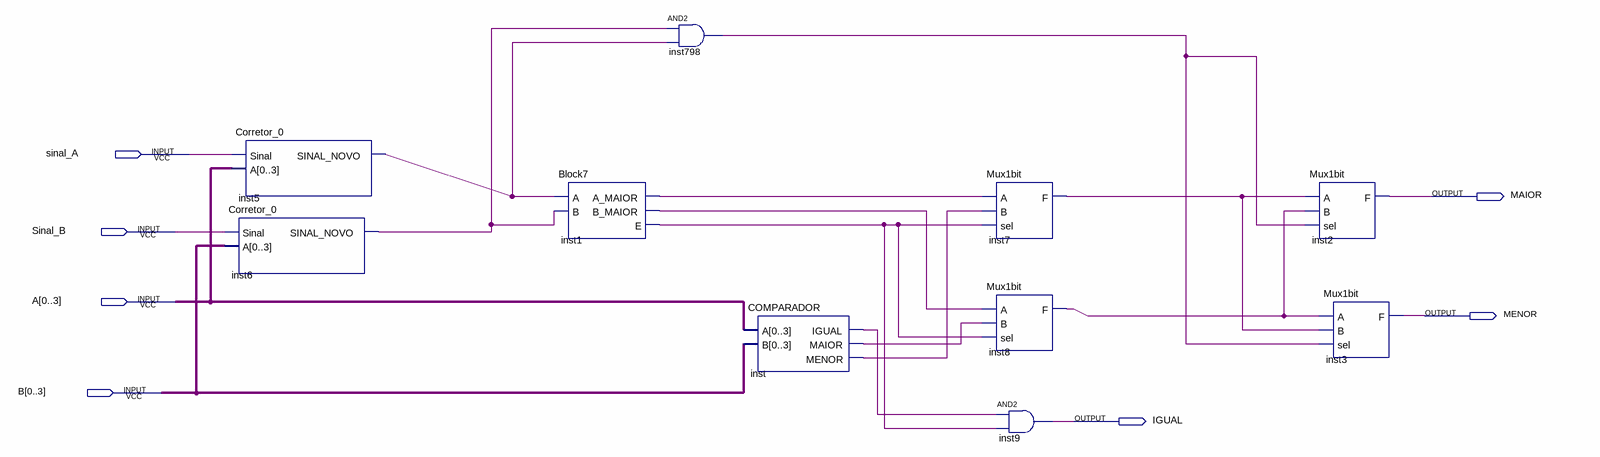
[diagram p0: schematic sheet]
// Quartus schematic COMPARADORPROJETO.bdf as structural Verilog: 10 symbols, 7 pins
module COMPARADORPROJETO (
  input  sinal_A,
  input  Sinal_B,
  input  [0:3] A,
  input  [0:3] B,
  output MAIOR,
  output MENOR,
  output IGUAL
);

  wire inst1_a_maior, inst1_b_maior, inst1_e, inst5_sinal_novo, inst6_sinal_novo, inst7_f, inst8_f,
       inst798_out, inst_igual, inst_maior, inst_menor;

  Corretor_0 inst5 (.Sinal(sinal_A), .A(A), .SINAL_NOVO(inst5_sinal_novo));
  Corretor_0 inst6 (.Sinal(Sinal_B), .A(B), .SINAL_NOVO(inst6_sinal_novo));
  Block7 inst1 (
    .A(inst5_sinal_novo), .B(inst6_sinal_novo), .A_MAIOR(inst1_a_maior), .B_MAIOR(inst1_b_maior), .E(inst1_e));
  and inst798 (inst798_out, inst6_sinal_novo, inst5_sinal_novo);
  COMPARADOR inst (.A(A), .B(B), .IGUAL(inst_igual), .MAIOR(inst_maior), .MENOR(inst_menor));
  Mux1bit inst7 (.A(inst1_a_maior), .B(inst_menor), .sel(inst1_e), .F(inst7_f));
  Mux1bit inst8 (.A(inst1_b_maior), .B(inst_maior), .sel(inst1_e), .F(inst8_f));
  and inst9 (IGUAL, inst_igual, inst1_e);
  Mux1bit inst2 (.A(inst7_f), .B(inst8_f), .sel(inst798_out), .F(MAIOR));
  Mux1bit inst3 (.A(inst8_f), .B(inst7_f), .sel(inst798_out), .F(MENOR));
endmodule
